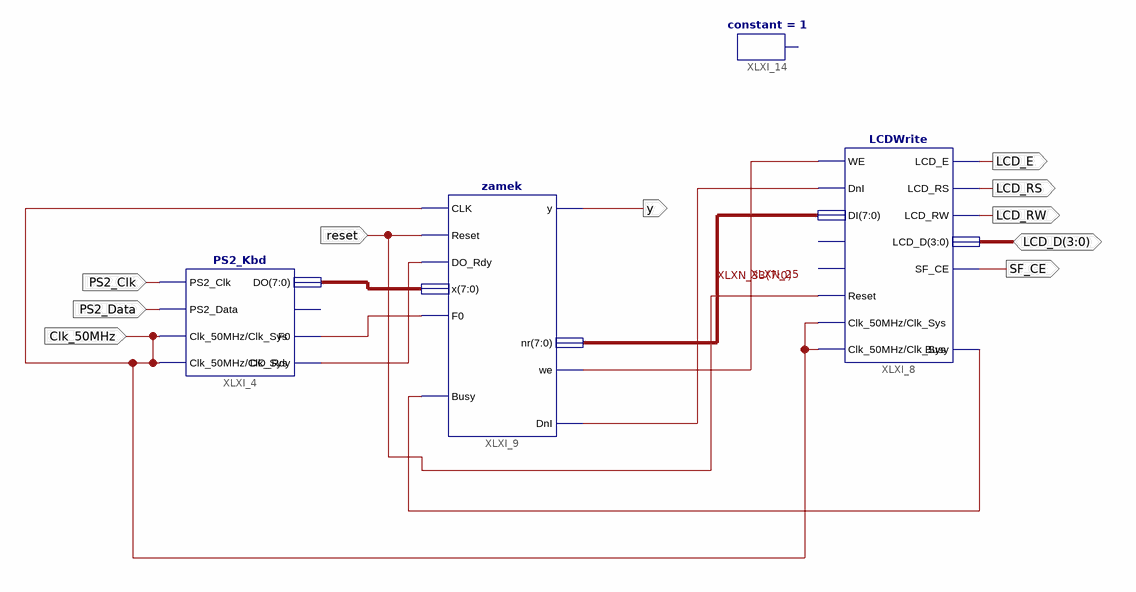
[diagram p0: schematic sheet 1]
// Xilinx ISE schematic zad_1.sch (spartan3e) as structural Verilog: 4 symbols, 10 ports
module zad_1 (
  input  PS2_Clk,
  input  Clk_50MHz,
  input  PS2_Data,
  input  reset,
  inout  [3:0] LCD_D,
  output y,
  output SF_CE,
  output LCD_RW,
  output LCD_RS,
  output LCD_E
);

  wire XLXN_7, XLXN_25, XLXN_31, XLXN_32, XLXN_34;
  wire [7:0] XLXN_1, XLXN_33;

  PS2_Kbd XLXI_4 (
    .PS2_Clk(PS2_Clk), .PS2_Data(PS2_Data), .Clk_50MHz(Clk_50MHz), .F0(XLXN_7), .DO_Rdy(XLXN_31),
    .DO(XLXN_1), .Clk_Sys(Clk_50MHz));  // open: E0
  zamek XLXI_9 (
    .CLK(Clk_50MHz), .Reset(reset), .DO_Rdy(XLXN_31), .F0(XLXN_7), .Busy(XLXN_32), .x(XLXN_1), .y(y),
    .we(XLXN_25), .DnI(XLXN_34), .nr(XLXN_33));
  LCDWrite XLXI_8 (
    .WE(XLXN_25), .DnI(XLXN_34), .Reset(reset), .DI(XLXN_33), .LCD_E(LCD_E), .LCD_RS(LCD_RS),
    .LCD_RW(LCD_RW), .LCD_D(LCD_D), .SF_CE(SF_CE), .Busy(XLXN_32), .Clk_50MHz(Clk_50MHz), .Clk_Sys(Clk_50MHz));  // open: Cursor, Blink
  constant #(.CValue("1")) XLXI_14 ();  // open: O
endmodule
